# Altium schematic sheet Steering_Wheel_Board.SchDoc
size A4
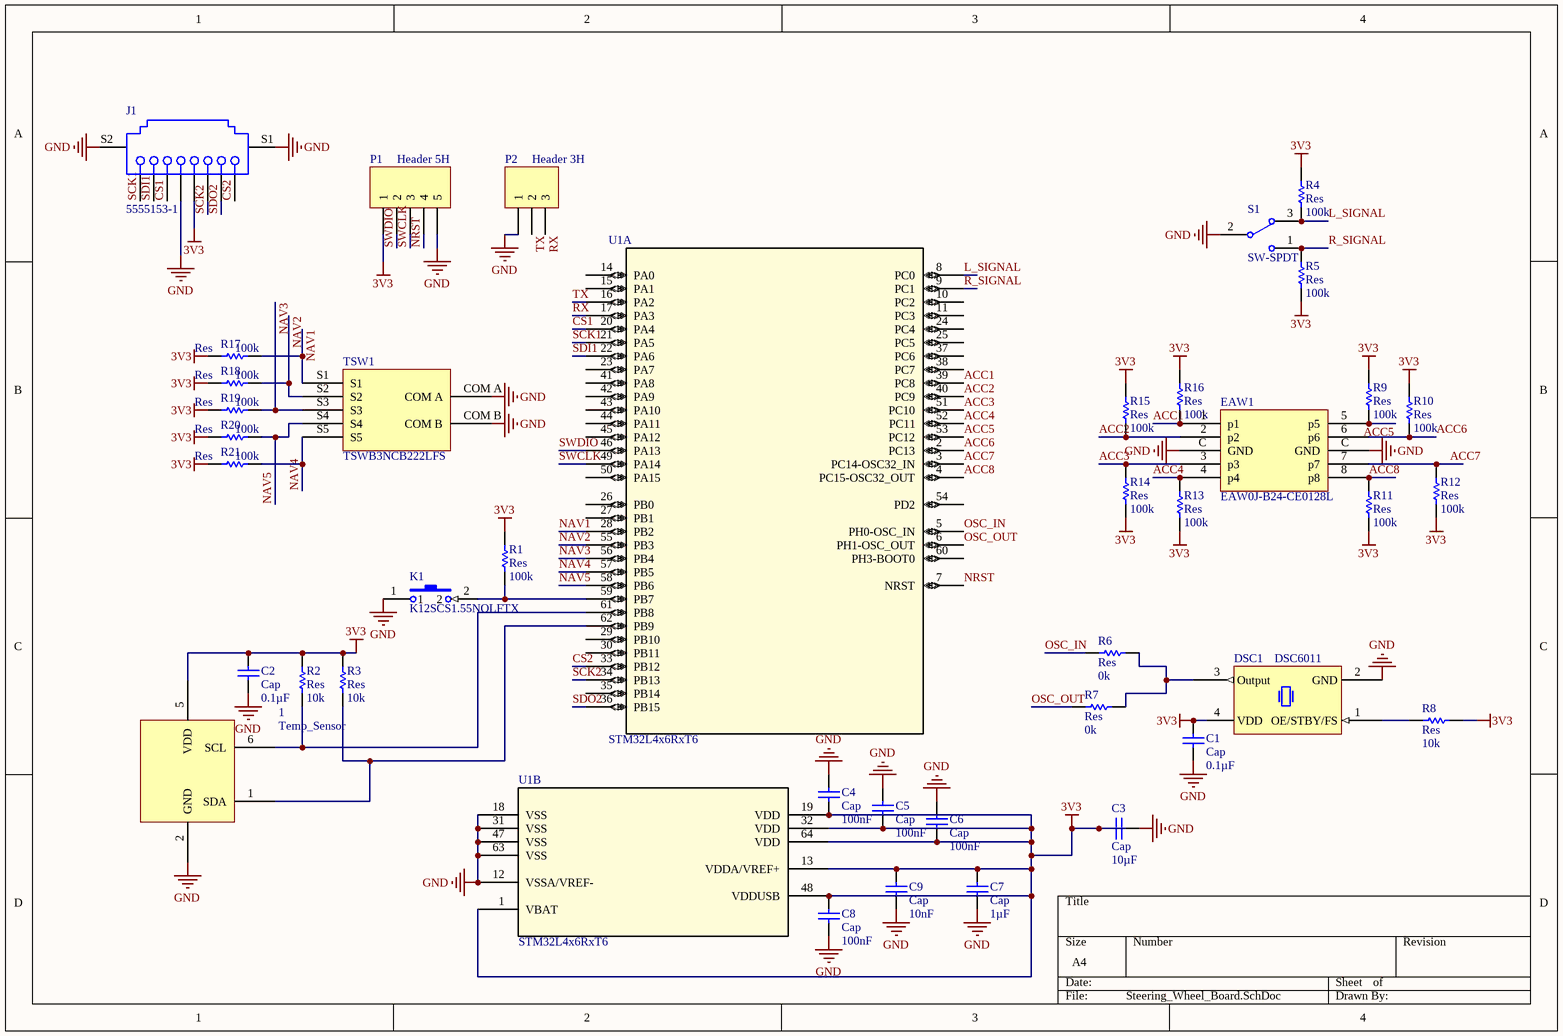
[diagram p0: Steering_Wheel_Board.SchDoc]

## Parts
1  Temp_Sensor  [Temp_Sensor]
C1  Cap  value 0.1µF  [C0805]
C2  Cap  value 0.1µF  [C0805]
C3  Cap  value 10µF  [C0805]
C4  Cap  value 100nF  [C0805]
C5  Cap  value 100nF  [C0805]
C6  Cap  value 100nF  [C0805]
C7  Cap  value 1µF  [C0805]
C8  Cap  value 100nF  [C0805]
C9  Cap  value 10nF  [C0805]
DSC1  DSC6011  [DSC6011JE1A-020.0000TCT-ND]
EAW1  EAW0J-B24-CE0128L  [EAW0J-B24-CE0128L]
J1  5555153-1  [RJ45 - CHN + DIGIKEY]
K1  K12SCS1.55NOLFTX  [Pushbutton]
P1  Header 5H  [HDR1X5H]
P2  Header 3H  [HDR1X3H]
R1  Res  value 100k  [C0805]
R2  Res  value 10k  [C0805]
R3  Res  value 10k  [C0805]
R4  Res  value 100k  [C0805]
R5  Res  value 100k  [C0805]
R6  Res  value 0k  [C0805]
R7  Res  value 0k  [C0805]
R8  Res  value 10k  [C0805]
R9  Res  value 100k  [C0805]
R10  Res  value 100k  [C0805]
R11  Res  value 100k  [C0805]
R12  Res  value 100k  [C0805]
R13  Res  value 100k  [C0805]
R14  Res  value 100k  [C0805]
R15  Res  value 100k  [C0805]
R16  Res  value 100k  [C0805]
R17  Res  value 100k  [C0805]
R18  Res  value 100k  [C0805]
R19  Res  value 100k  [C0805]
R20  Res  value 100k  [C0805]
R21  Res  value 100k  [C0805]
S1  SW-SPDT  [3POSSPDT]
TSW1  TSWB3NCB222LFS  [TSWB3NCB222LFS]
U1  STM32L4x6RxT6  [LQFP64-10x10mm]  (parts A,B of 2)

## Nets
3V3: 1.5(VDD) C1.2 C2.2 C3.2 C4.2 C5.2 C6.2 C7.2 C8.2 C9.2 DSC1.4(VDD) J1.5(RD+) P1.1 R1.1 R2.1 R3.1 R4.1 R5.2 R8.2 R9.1 R10.1 R11.2 R12.2 R13.2 R14.2 R15.1 R16.1 R17.1 R18.1 R19.1 R20.1 R21.1 U1.1(VBAT) U1.13(VDDA/VREF+) U1.19(VDD) U1.32(VDD) U1.48(VDDUSB) U1.64(VDD)
GND: 1.2(GND) C1.1 C2.1 C3.1 C4.1 C5.1 C6.1 C7.1 C8.1 C9.1 DSC1.2(GND) EAW1.C(GND) J1.4(NC) J1.S1 J1.S2 K1.1 P1.5 P2.1 S1.2 TSW1.COM_A TSW1.COM_B U1.12(VSSA/VREF-) U1.18(VSS) U1.31(VSS) U1.47(VSS) U1.63(VSS)
ACC1: EAW1.1(p1) R16.2 U1.39(PC8)
ACC2: EAW1.2(p2) R15.2 U1.40(PC9)
ACC3: EAW1.3(p3) R14.1 U1.51(PC10)
ACC4: EAW1.4(p4) R13.1 U1.52(PC11)
ACC5: EAW1.5(p5) R9.2 U1.53(PC12)
ACC6: EAW1.6(p6) R10.2 U1.2(PC13)
ACC7: EAW1.7(p7) R12.1 U1.3(PC14-OSC32_IN)
ACC8: EAW1.8(p8) R11.1 U1.4(PC15-OSC32_OUT)
CS1: J1.3(TD-) U1.20(PA4)
CS2: J1.8(GND) U1.33(PB12)
L_SIGNAL: R4.2 S1.3 U1.8(PC0)
NAV1: R17.2 TSW1.S1 U1.28(PB2)
NAV2: R18.2 TSW1.S2 U1.55(PB3)
NAV3: R19.2 TSW1.S3 U1.56(PB4)
NAV4: R21.2 TSW1.S5 U1.57(PB5)
NAV5: R20.2 TSW1.S4 U1.58(PB6)
NRST: P1.4 U1.7(NRST)
OSC_IN: R6.1 U1.5(PH0-OSC_IN)
OSC_OUT: R7.1 U1.6(PH1-OSC_OUT)
R_SIGNAL: R5.1 S1.1 U1.9(PC1)
RX: P2.3 U1.17(PA3)
SCK1: J1.1(TD+) U1.21(PA5)
SCK2: J1.6(RCT) U1.34(PB13)
SDI1: J1.2(TCT) U1.22(PA6)
SDO2: J1.7(RD-) U1.36(PB15)
SWCLK: P1.3 U1.49(PA14)
SWDIO: P1.2 U1.46(PA13)
TX: P2.2 U1.16(PA2)
Net1_1: 1.1(SDA) R3.2 U1.62(PB9)
Net1_6: 1.6(SCL) R2.2 U1.61(PB8)
NetDSC1_1: DSC1.1(OE/STBY/FS) R8.1
NetDSC1_3: DSC1.3(Output) R6.2 R7.2
NetK1_2: K1.2 R1.2 U1.59(PB7)

Not connected (* = marked no-connect by the designer): U1 10(PC2) 11(PC3) 14(PA0) 15(PA1) 23(PA7) 24(PC4) 25(PC5) 26(PB0) 27(PB1) 29(PB10) 30(PB11) 35(PB14) 37(PC6) 38(PC7) 41(PA8) 42(PA9) 43(PA10) 44(PA11) 45(PA12) 50(PA15) 54(PD2) 60(PH3-BOOT0)

## Library data of the parts
1 = Temp_Sensor: Si7000-A20 Temperature and Humidity Sensor
C1-C9 = Cap: Capacitor; Published: 8-Jun-2000; LatestRevisionDate: 17-Jul-2002; LatestRevisionNote: Re-released for DXP Platform.; PackageReference: RAD-0.3; Publisher: Altium Limited
EAW1 = EAW0J-B24-CE0128L: Rotary Encoder - 8 pins
J1 = CMP-2000-05640-1: RJ45 Connector, Pitch 1.27 mm, 8 Position, Height 13.08 mm, Tail Length 3.81 mm, -40 to 85 degC, RoHS, Tray; pin to pad: S1>11 S2>12; Manufacturer: TE Connectivity; Number of Ports: 1; Shielding: Shielded; 3D Model: 5555153-1.pdf; Catalog Drawings: JackSideEntryRightAngle / JackSideEntryRightAngleTop; Ratings: Cat3; Connector Type: Jack; LED Color: DoesNotContainLED; Other Names: A31438; Tab Direction: Down; Number of Positions/Contacts: 8p8c(RJ45,Ethernet); Dynamic Catalog: ModularJacks; Contact Finish: Gold; Operating Temperature: -40°C~85°C; Contact Finish Thickness: 50µin(1.27µm); Datasheet URL: http://www.te.com/commerce/DocumentDelivery/DDEController?Action=srchrtrv&DocNm=5555153&DocType=Customer+Drawing&DocLang=English&DocFormat=pdf&PartCntxt=5555153-1; Mounting Type: ThroughHole; Package Reference: 5555153-1; RoHS Information: 5555153-1StatementofCompliance; Package Description: RJ45 Connector, Pitch 1.27 mm, 8 Position, Height 13.08 mm, Tail Length 3.81 mm; Family: ModularConnectors-Jacks; Orientation: 90°Angle(Right); Packaging: Tray; Number of Rows: 1; Mounting Technology: ThroughHole; Contact Material: PhosphorBronze; Manufacturer URL: http://www.te.com/; Datasheet Version: Rev. D2, 05/2016; Housing Material: PolybutyleneTerephthalate(PBT),Polyester; Features: BoardLock,PanelStops; Standard Package: 136; Termination: Solder; Category: Connectors,Interconnects
K1 = Pushbutton
P1 = Header 5H: Header, 5-Pin, Right Angle; LatestRevisionDate: 17-Jul-2002; LatestRevisionNote: Re-released for DXP Platform.; Publisher: Altium Limited
P2 = Header 3H: Header, 3-Pin, Right Angle; LatestRevisionDate: 17-Jul-2002; LatestRevisionNote: Re-released for DXP Platform.; Publisher: Altium Limited
R1 R4-R7 R9-R21 = Res: Rectangular Thick Film Chip Resistor, 10 Ohm to 1M Ohm Range, 0.1% and 0.5% Tolerance, 0805 Size, 0.1 W; Note: If flow soldering, adjust pad width of PCB Footprint to 0.7 - 0.8 times the width of the resistor.; Published: 17-Dec-2003; LatestRevisionDate: 19-Mar-2004; LatestRevisionNote: Silkscreen size reduced.; PackageDocument: Mar-2003; PackageReference: ERA-0805; Publisher: Altium Limited; Code_IPC: 2012 [0805]; ComponentLink1Description: Manufacturer Link; ComponentLink1URL: http://www.panasonic.com/industrial/components/resistive_products.htm; ComponentLink2Description: Datasheet; ComponentLink2URL: http://www.panasonic.com/industrial/components/pdf/AOA0000CE8.pdf
R2 R3 R8 = Res: Note: If flow soldering, adjust pad width of PCB Footprint to 0.7 - 0.8 times the width of the resistor.; Published: 17-Dec-2003; LatestRevisionDate: 19-Mar-2004; LatestRevisionNote: Silkscreen size reduced.; PackageDocument: Mar-2003; PackageReference: ERA-0805; Publisher: Altium Limited; Code_IPC: 2012 [0805]
S1 = SW-SPDT: SPDT Subminiature Toggle Switch, Right Angle Mounting, Vertical Actuation; Published: 24-Mar-1999; LatestRevisionDate: 17-Dec-2003; LatestRevisionNote: Schematic revised, PCB Footprint replaced.; DatasheetVersion: 05-Dec-2000; PackageReference: TL36WW15050; Publisher: Altium Limited; PackageDescription: Switch; 4 Leads; ComponentLink1Description: Manufacturer Link; ComponentLink1URL: http://www.apem.com
TSW1 = TSWB3NCB222LFS: Navigational Switch
U1 = STM32L4x6RxT6: Imported; Vendor: STMicroelectronics; C: Copyright (C) 2016 Accelerated Designs. All rights reserved; Copyright: Copyright (C) 2016 Accelerated Designs. All rights reserved; Manufacturer_Part_Number: stm32l4x6rxt6; RefDes: RefDes; Type: DEV; Value: Value